# EAGLE design conector_santec (EAGLE 7.5.0)
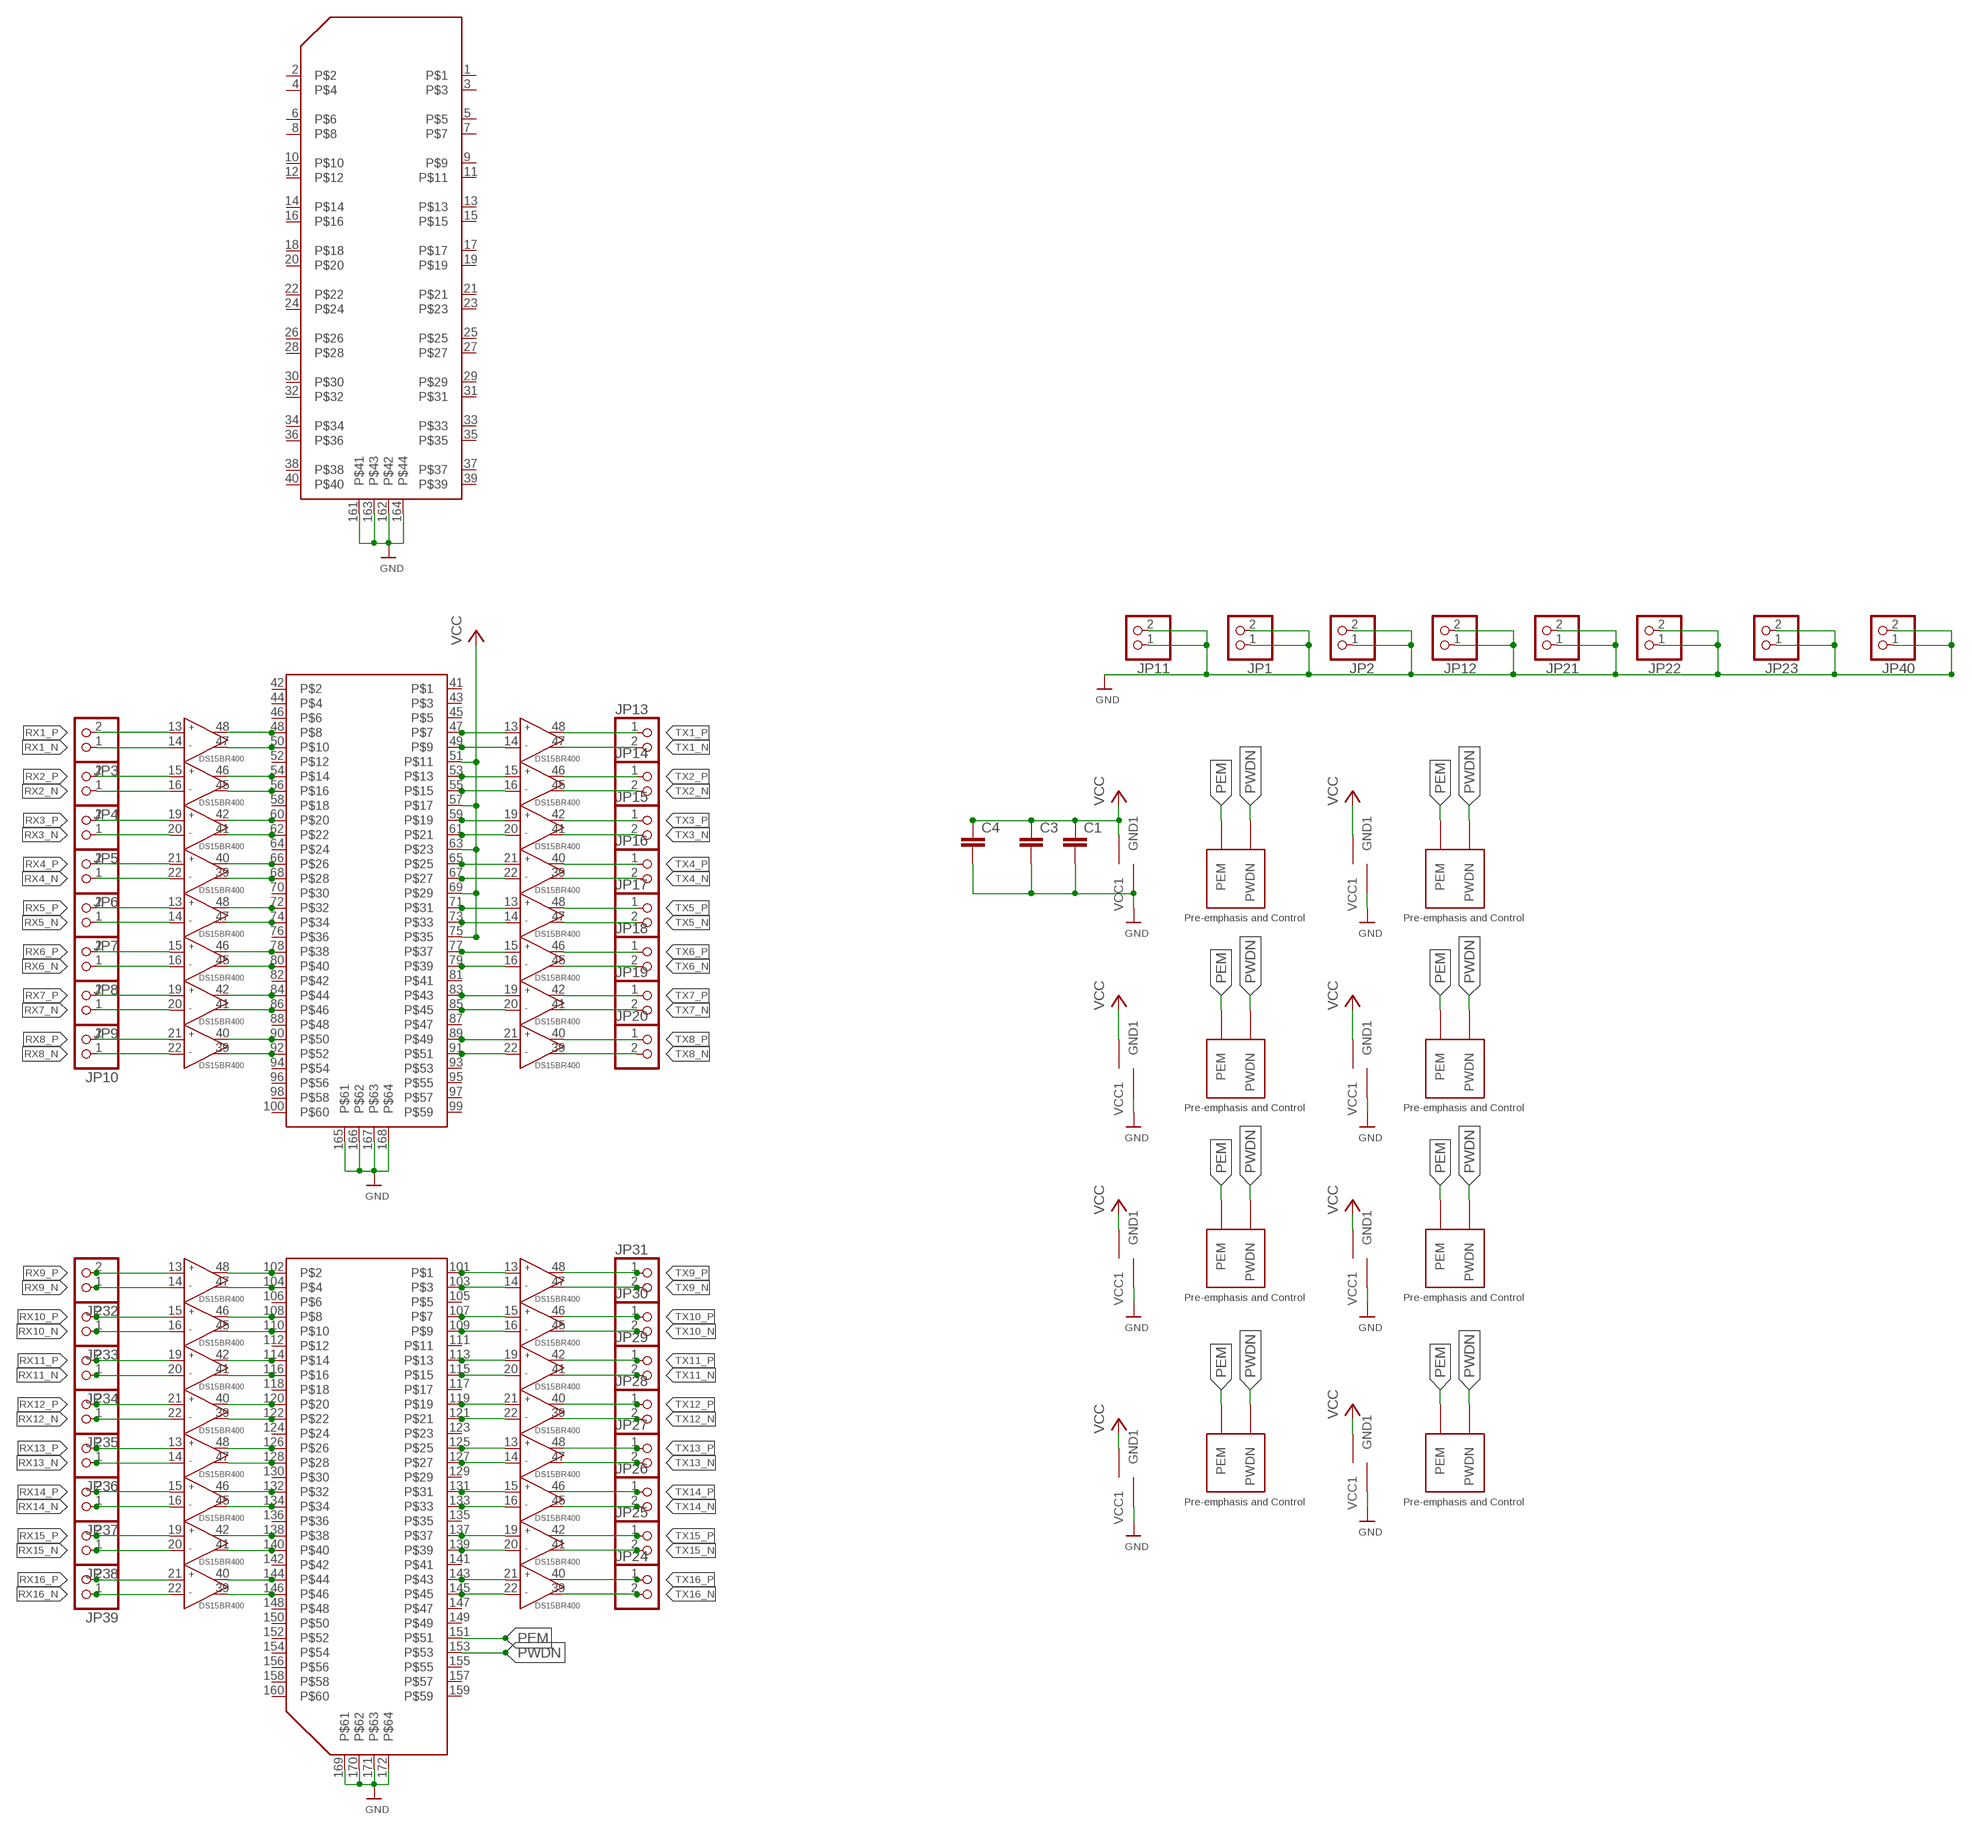
[diagram p0: schematic, sheet 1]

## Parts
C1  C-EUC0603  [C0603]
C3  C-EUC0603  [C0603]
C4  C-EUC0603  [C0603]
JP1  HEADER-1X2ROUND  [1X02_ROUND]
JP2  HEADER-1X2ROUND  [1X02_ROUND]
JP3  HEADER-1X2ROUND  [1X02_ROUND]
JP4  HEADER-1X2ROUND  [1X02_ROUND]
JP5  HEADER-1X2ROUND  [1X02_ROUND]
JP6  HEADER-1X2ROUND  [1X02_ROUND]
JP7  HEADER-1X2ROUND  [1X02_ROUND]
JP8  HEADER-1X2ROUND  [1X02_ROUND]
JP9  HEADER-1X2ROUND  [1X02_ROUND]
JP10  HEADER-1X2ROUND  [1X02_ROUND]
JP11  HEADER-1X2ROUND  [1X02_ROUND]
JP12  HEADER-1X2ROUND  [1X02_ROUND]
JP13  HEADER-1X2ROUND  [1X02_ROUND]
JP14  HEADER-1X2ROUND  [1X02_ROUND]
JP15  HEADER-1X2ROUND  [1X02_ROUND]
JP16  HEADER-1X2ROUND  [1X02_ROUND]
JP17  HEADER-1X2ROUND  [1X02_ROUND]
JP18  HEADER-1X2ROUND  [1X02_ROUND]
JP19  HEADER-1X2ROUND  [1X02_ROUND]
JP20  HEADER-1X2ROUND  [1X02_ROUND]
JP21  HEADER-1X2ROUND  [1X02_ROUND]
JP22  HEADER-1X2ROUND  [1X02_ROUND]
JP23  HEADER-1X2ROUND  [1X02_ROUND]
JP24  HEADER-1X2ROUND  [1X02_ROUND]
JP25  HEADER-1X2ROUND  [1X02_ROUND]
JP26  HEADER-1X2ROUND  [1X02_ROUND]
JP27  HEADER-1X2ROUND  [1X02_ROUND]
JP28  HEADER-1X2ROUND  [1X02_ROUND]
JP29  HEADER-1X2ROUND  [1X02_ROUND]
JP30  HEADER-1X2ROUND  [1X02_ROUND]
JP31  HEADER-1X2ROUND  [1X02_ROUND]
JP32  HEADER-1X2ROUND  [1X02_ROUND]
JP33  HEADER-1X2ROUND  [1X02_ROUND]
JP34  HEADER-1X2ROUND  [1X02_ROUND]
JP35  HEADER-1X2ROUND  [1X02_ROUND]
JP36  HEADER-1X2ROUND  [1X02_ROUND]
JP37  HEADER-1X2ROUND  [1X02_ROUND]
JP38  HEADER-1X2ROUND  [1X02_ROUND]
JP39  HEADER-1X2ROUND  [1X02_ROUND]
JP40  HEADER-1X2ROUND  [1X02_ROUND]
U$1  SAMTEC_ASP-122952-01  [ASP-122952-01]
U$4  DS15BR400  [TQFP48]
U$6  DS15BR400  [TQFP48]
U$7  DS15BR400  [TQFP48]
U$8  DS15BR400  [TQFP48]
U$15  DS15BR400  [TQFP48]
U$16  DS15BR400  [TQFP48]
U$17  DS15BR400  [TQFP48]
U$18  DS15BR400  [TQFP48]

## Nets
GND [lvds]: C1.2 C3.2 C4.2 JP1.1 JP1.2 JP2.1 JP2.2 JP11.1 JP11.2 JP12.1 JP12.2 JP21.1 JP21.2 JP22.1 JP22.2 JP23.1 JP23.2 JP40.1 JP40.2 U$1.161 U$1.162 U$1.163 U$1.164 U$1.165 U$1.166 U$1.167 U$1.168 U$1.169 U$1.170 U$1.171 U$1.172 U$4.8(GND1) U$4.9(GND1) U$4.17(GND1) U$4.18(GND1) U$4.23(GND1) U$4.24(GND1) U$4.37(GND1) U$4.38(GND1) U$4.43(GND1) U$4.44(GND1) U$6.8(GND1) U$6.9(GND1) U$6.17(GND1) U$6.18(GND1) U$6.23(GND1) U$6.24(GND1) U$6.37(GND1) U$6.38(GND1) U$6.43(GND1) U$6.44(GND1) U$7.8(GND1) U$7.9(GND1) U$7.17(GND1) U$7.18(GND1) U$7.23(GND1) U$7.24(GND1) U$7.37(GND1) U$7.38(GND1) U$7.43(GND1) U$7.44(GND1) U$8.8(GND1) U$8.9(GND1) U$8.17(GND1) U$8.18(GND1) U$8.23(GND1) U$8.24(GND1) U$8.37(GND1) U$8.38(GND1) U$8.43(GND1) U$8.44(GND1) U$15.8(GND1) U$15.9(GND1) U$15.17(GND1) U$15.18(GND1) U$15.23(GND1) U$15.24(GND1) U$15.37(GND1) U$15.38(GND1) U$15.43(GND1) U$15.44(GND1) U$16.8(GND1) U$16.9(GND1) U$16.17(GND1) U$16.18(GND1) U$16.23(GND1) U$16.24(GND1) U$16.37(GND1) U$16.38(GND1) U$16.43(GND1) U$16.44(GND1) U$17.8(GND1) U$17.9(GND1) U$17.17(GND1) U$17.18(GND1) U$17.23(GND1) U$17.24(GND1) U$17.37(GND1) U$17.38(GND1) U$17.43(GND1) U$17.44(GND1) U$18.8(GND1) U$18.9(GND1) U$18.17(GND1) U$18.18(GND1) U$18.23(GND1) U$18.24(GND1) U$18.37(GND1) U$18.38(GND1) U$18.43(GND1) U$18.44(GND1)
PEM: U$1.151 U$4.2(PEM) U$6.2(PEM) U$7.2(PEM) U$8.2(PEM) U$15.2(PEM) U$16.2(PEM) U$17.2(PEM) U$18.2(PEM)
PWDN: U$1.153 U$4.12(PWDN) U$6.12(PWDN) U$7.12(PWDN) U$8.12(PWDN) U$15.12(PWDN) U$16.12(PWDN) U$17.12(PWDN) U$18.12(PWDN)
RX1_N [lvds]: JP3.1 U$7.14(IN-)
RX1_P [lvds]: JP3.2 U$7.13(IN+)
RX1IN_N [lvds]: U$1.50 U$7.47(OUT-)
RX1IN_P [lvds]: U$1.48 U$7.48(OUT+)
RX2_N [lvds]: JP4.1 U$7.16(IN-)
RX2_P [lvds]: JP4.2 U$7.15(IN+)
RX2IN_N [lvds]: U$1.56 U$7.45(OUT-)
RX2IN_P [lvds]: U$1.54 U$7.46(OUT+)
RX3_N [lvds]: JP5.1 U$7.20(IN-)
RX3_P [lvds]: JP5.2 U$7.19(IN+)
RX3IN_N [lvds]: U$1.62 U$7.41(OUT-)
RX3IN_P [lvds]: U$1.60 U$7.42(OUT+)
RX4_N [lvds]: JP6.1 U$7.22(IN-)
RX4_P [lvds]: JP6.2 U$7.21(IN+)
RX4IN_N [lvds]: U$1.68 U$7.39(OUT-)
RX4IN_P [lvds]: U$1.66 U$7.40(OUT+)
RX5_N [lvds]: JP7.1 U$8.14(IN-)
RX5_P [lvds]: JP7.2 U$8.13(IN+)
RX5IN_N [lvds]: U$1.74 U$8.47(OUT-)
RX5IN_P [lvds]: U$1.72 U$8.48(OUT+)
RX6_N [lvds]: JP8.1 U$8.16(IN-)
RX6_P [lvds]: JP8.2 U$8.15(IN+)
RX6IN_N [lvds]: U$1.80 U$8.45(OUT-)
RX6IN_P [lvds]: U$1.78 U$8.46(OUT+)
RX7_N [lvds]: JP9.1 U$8.20(IN-)
RX7_P [lvds]: JP9.2 U$8.19(IN+)
RX7IN_N [lvds]: U$1.86 U$8.41(OUT-)
RX7IN_P [lvds]: U$1.84 U$8.42(OUT+)
RX8_N [lvds]: JP10.1 U$8.22(IN-)
RX8_P [lvds]: JP10.2 U$8.21(IN+)
RX8IN_N [lvds]: U$1.92 U$8.39(OUT-)
RX8IN_P [lvds]: U$1.90 U$8.40(OUT+)
RX9_N [lvds]: JP32.1 U$17.14(IN-)
RX9_P [lvds]: JP32.2 U$17.13(IN+)
RX9IN_N [lvds]: U$1.104 U$17.47(OUT-)
RX9IN_P [lvds]: U$1.102 U$17.48(OUT+)
RX10_N [lvds]: JP33.1 U$17.16(IN-)
RX10_P [lvds]: JP33.2 U$17.15(IN+)
RX10IN_N [lvds]: U$1.110 U$17.45(OUT-)
RX10IN_P [lvds]: U$1.108 U$17.46(OUT+)
RX11_N [lvds]: JP34.1 U$17.20(IN-)
RX11_P [lvds]: JP34.2 U$17.19(IN+)
RX11IN_N [lvds]: U$1.116 U$17.41(OUT-)
RX11IN_P [lvds]: U$1.114 U$17.42(OUT+)
RX12_N [lvds]: JP35.1 U$17.22(IN-)
RX12_P [lvds]: JP35.2 U$17.21(IN+)
RX12IN_N [lvds]: U$1.122 U$17.39(OUT-)
RX12IN_P [lvds]: U$1.120 U$17.40(OUT+)
RX13_N [lvds]: JP36.1 U$18.14(IN-)
RX13_P [lvds]: JP36.2 U$18.13(IN+)
RX13IN_N [lvds]: U$1.128 U$18.47(OUT-)
RX13IN_P [lvds]: U$1.126 U$18.48(OUT+)
RX14_N [lvds]: JP37.1 U$18.16(IN-)
RX14_P [lvds]: JP37.2 U$18.15(IN+)
RX14IN_N [lvds]: U$1.134 U$18.45(OUT-)
RX14IN_P [lvds]: U$1.132 U$18.46(OUT+)
RX15_N [lvds]: JP38.1 U$18.20(IN-)
RX15_P [lvds]: JP38.2 U$18.19(IN+)
RX15IN_N [lvds]: U$1.140 U$18.41(OUT-)
RX15IN_P [lvds]: U$1.138 U$18.42(OUT+)
RX16_N [lvds]: JP39.1 U$18.22(IN-)
RX16_P [lvds]: JP39.2 U$18.21(IN+)
RX16IN_N [lvds]: U$1.146 U$18.39(OUT-)
RX16IN_P [lvds]: U$1.144 U$18.40(OUT+)
TX1_N [lvds]: JP13.2 U$4.47(OUT-)
TX1_P [lvds]: JP13.1 U$4.48(OUT+)
TX1IN_N [lvds]: U$1.49 U$4.14(IN-)
TX1IN_P [lvds]: U$1.47 U$4.13(IN+)
TX2_N [lvds]: JP14.2 U$4.45(OUT-)
TX2_P [lvds]: JP14.1 U$4.46(OUT+)
TX2IN_N [lvds]: U$1.55 U$4.16(IN-)
TX2IN_P [lvds]: U$1.53 U$4.15(IN+)
TX3_N [lvds]: JP15.2 U$4.41(OUT-)
TX3_P [lvds]: JP15.1 U$4.42(OUT+)
TX3IN_N [lvds]: U$1.61 U$4.20(IN-)
TX3IN_P [lvds]: U$1.59 U$4.19(IN+)
TX4_N [lvds]: JP16.2 U$4.39(OUT-)
TX4_P [lvds]: JP16.1 U$4.40(OUT+)
TX4IN_N [lvds]: U$1.67 U$4.22(IN-)
TX4IN_P [lvds]: U$1.65 U$4.21(IN+)
TX5_N [lvds]: JP17.2 U$6.47(OUT-)
TX5_P [lvds]: JP17.1 U$6.48(OUT+)
TX5IN_N [lvds]: U$1.73 U$6.14(IN-)
TX5IN_P [lvds]: U$1.71 U$6.13(IN+)
TX6_N [lvds]: JP18.2 U$6.45(OUT-)
TX6_P [lvds]: JP18.1 U$6.46(OUT+)
TX6IN_N [lvds]: U$1.79 U$6.16(IN-)
TX6IN_P [lvds]: U$1.77 U$6.15(IN+)
TX7_N [lvds]: JP19.2 U$6.41(OUT-)
TX7_P [lvds]: JP19.1 U$6.42(OUT+)
TX7IN_N [lvds]: U$1.85 U$6.20(IN-)
TX7IN_P [lvds]: U$1.83 U$6.19(IN+)
TX8_N [lvds]: JP20.2 U$6.39(OUT-)
TX8_P [lvds]: JP20.1 U$6.40(OUT+)
TX8IN_N [lvds]: U$1.91 U$6.22(IN-)
TX8IN_P [lvds]: U$1.89 U$6.21(IN+)
TX9_N [lvds]: JP31.2 U$15.47(OUT-)
TX9_P [lvds]: JP31.1 U$15.48(OUT+)
TX9IN_N [lvds]: U$1.103 U$15.14(IN-)
TX9IN_P [lvds]: U$1.101 U$15.13(IN+)
TX10_N [lvds]: JP30.2 U$15.45(OUT-)
TX10_P [lvds]: JP30.1 U$15.46(OUT+)
TX10IN_N [lvds]: U$1.109 U$15.16(IN-)
TX10IN_P [lvds]: U$1.107 U$15.15(IN+)
TX11_N [lvds]: JP29.2 U$15.41(OUT-)
TX11_P [lvds]: JP29.1 U$15.42(OUT+)
TX11IN_N [lvds]: U$1.115 U$15.20(IN-)
TX11IN_P [lvds]: U$1.113 U$15.19(IN+)
TX12_N [lvds]: JP28.2 U$15.39(OUT-)
TX12_P [lvds]: JP28.1 U$15.40(OUT+)
TX12IN_N [lvds]: U$1.121 U$15.22(IN-)
TX12IN_P [lvds]: U$1.119 U$15.21(IN+)
TX13_N [lvds]: JP27.2 U$16.47(OUT-)
TX13_P [lvds]: JP27.1 U$16.48(OUT+)
TX13IN_N [lvds]: U$1.127 U$16.14(IN-)
TX13IN_P [lvds]: U$1.125 U$16.13(IN+)
TX14_N [lvds]: JP26.2 U$16.45(OUT-)
TX14_P [lvds]: JP26.1 U$16.46(OUT+)
TX14IN_N [lvds]: U$1.133 U$16.16(IN-)
TX14IN_P [lvds]: U$1.131 U$16.15(IN+)
TX15_N [lvds]: JP25.2 U$16.41(OUT-)
TX15_P [lvds]: JP25.1 U$16.42(OUT+)
TX15IN_N [lvds]: U$1.139 U$16.20(IN-)
TX15IN_P [lvds]: U$1.137 U$16.19(IN+)
TX16_N [lvds]: JP24.2 U$16.39(OUT-)
TX16_P [lvds]: JP24.1 U$16.40(OUT+)
TX16IN_N [lvds]: U$1.145 U$16.22(IN-)
TX16IN_P [lvds]: U$1.143 U$16.21(IN+)
VCC: C1.1 C3.1 C4.1 U$1.51 U$1.57 U$1.63 U$1.69 U$1.75 U$4.3(VCC1) U$4.4(VCC1) U$4.5(VCC1) U$4.7(VCC1) U$4.10(VCC1) U$4.11(VCC1) U$4.28(VCC1) U$4.29(VCC1) U$4.30(VCC1) U$4.32(VCC1) U$4.33(VCC1) U$6.3(VCC1) U$6.4(VCC1) U$6.5(VCC1) U$6.7(VCC1) U$6.10(VCC1) U$6.11(VCC1) U$6.28(VCC1) U$6.29(VCC1) U$6.30(VCC1) U$6.32(VCC1) U$6.33(VCC1) U$7.3(VCC1) U$7.4(VCC1) U$7.5(VCC1) U$7.7(VCC1) U$7.10(VCC1) U$7.11(VCC1) U$7.28(VCC1) U$7.29(VCC1) U$7.30(VCC1) U$7.32(VCC1) U$7.33(VCC1) U$8.3(VCC1) U$8.4(VCC1) U$8.5(VCC1) U$8.7(VCC1) U$8.10(VCC1) U$8.11(VCC1) U$8.28(VCC1) U$8.29(VCC1) U$8.30(VCC1) U$8.32(VCC1) U$8.33(VCC1) U$15.3(VCC1) U$15.4(VCC1) U$15.5(VCC1) U$15.7(VCC1) U$15.10(VCC1) U$15.11(VCC1) U$15.28(VCC1) U$15.29(VCC1) U$15.30(VCC1) U$15.32(VCC1) U$15.33(VCC1) U$16.3(VCC1) U$16.4(VCC1) U$16.5(VCC1) U$16.7(VCC1) U$16.10(VCC1) U$16.11(VCC1) U$16.28(VCC1) U$16.29(VCC1) U$16.30(VCC1) U$16.32(VCC1) U$16.33(VCC1) U$17.3(VCC1) U$17.4(VCC1) U$17.5(VCC1) U$17.7(VCC1) U$17.10(VCC1) U$17.11(VCC1) U$17.28(VCC1) U$17.29(VCC1) U$17.30(VCC1) U$17.32(VCC1) U$17.33(VCC1) U$18.3(VCC1) U$18.4(VCC1) U$18.5(VCC1) U$18.7(VCC1) U$18.10(VCC1) U$18.11(VCC1) U$18.28(VCC1) U$18.29(VCC1) U$18.30(VCC1) U$18.32(VCC1) U$18.33(VCC1)
Unconnected: U$1.1 U$1.2 U$1.3 U$1.4 U$1.5 U$1.6 U$1.7 U$1.8 U$1.9 U$1.10 U$1.11 U$1.12 U$1.13 U$1.14 U$1.15 U$1.16 U$1.17 U$1.18 U$1.19 U$1.20 U$1.21 U$1.22 U$1.23 U$1.24 U$1.25 U$1.26 U$1.27 U$1.28 U$1.29 U$1.30 U$1.31 U$1.32 U$1.33 U$1.34 U$1.35 U$1.36 U$1.37 U$1.38 U$1.39 U$1.40 U$1.41 U$1.42 U$1.43 U$1.44 U$1.45 U$1.46 U$1.52 U$1.58 U$1.64 U$1.70 U$1.76 U$1.81 U$1.82 U$1.87 U$1.88 U$1.93 U$1.94 U$1.95 U$1.96 U$1.97 U$1.98 U$1.99 U$1.100 U$1.105 U$1.106 U$1.111 U$1.112 U$1.117 U$1.118 U$1.123 U$1.124 U$1.129 U$1.130 U$1.135 U$1.136 U$1.141 U$1.142 U$1.147 U$1.148 U$1.149 U$1.150 U$1.152 U$1.154 U$1.155 U$1.156 U$1.157 U$1.158 U$1.159 U$1.160

## Library data of the parts
C1 C3 C4 = rcl:C-EU: CAPACITOR, European symbol
JP1-JP40 = junior:HEADER-1X2: PIN HEADER
U$1 = junior:SAMTEC_ASP-122952-01
U$4 U$6-U$8 U$15-U$18 = National:DS15BR400

## Net classes
0 default: width 0.305 mm
1 lvds: width 0.305 mm

## Board
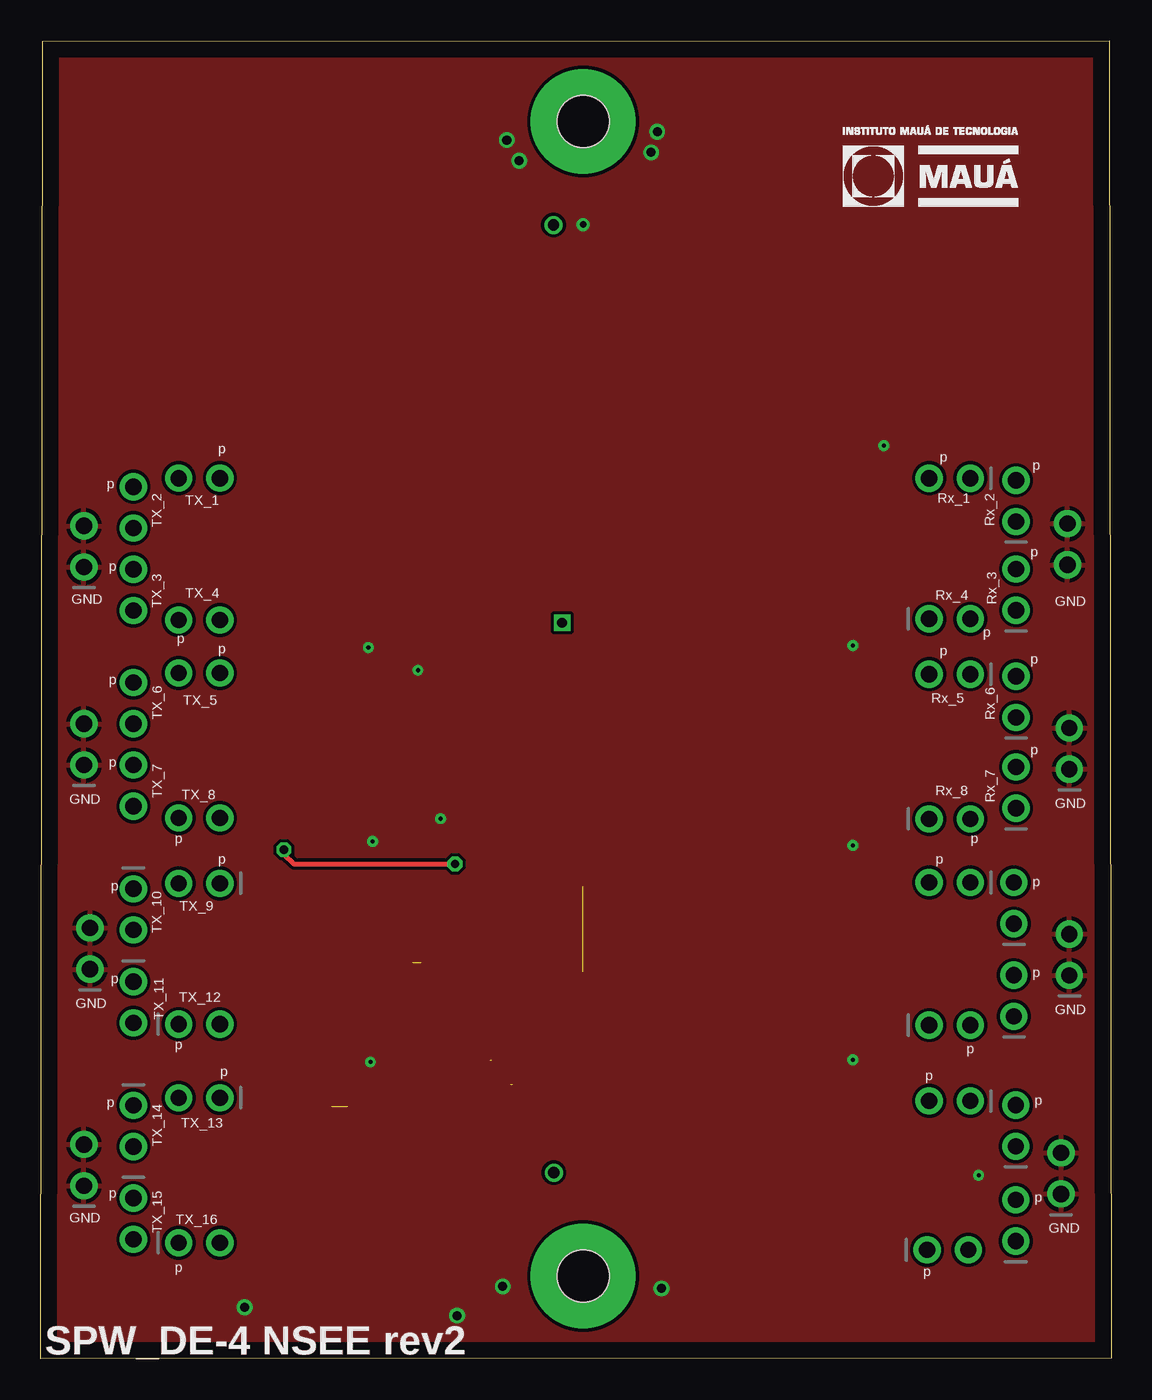
[diagram p1: board, top side]
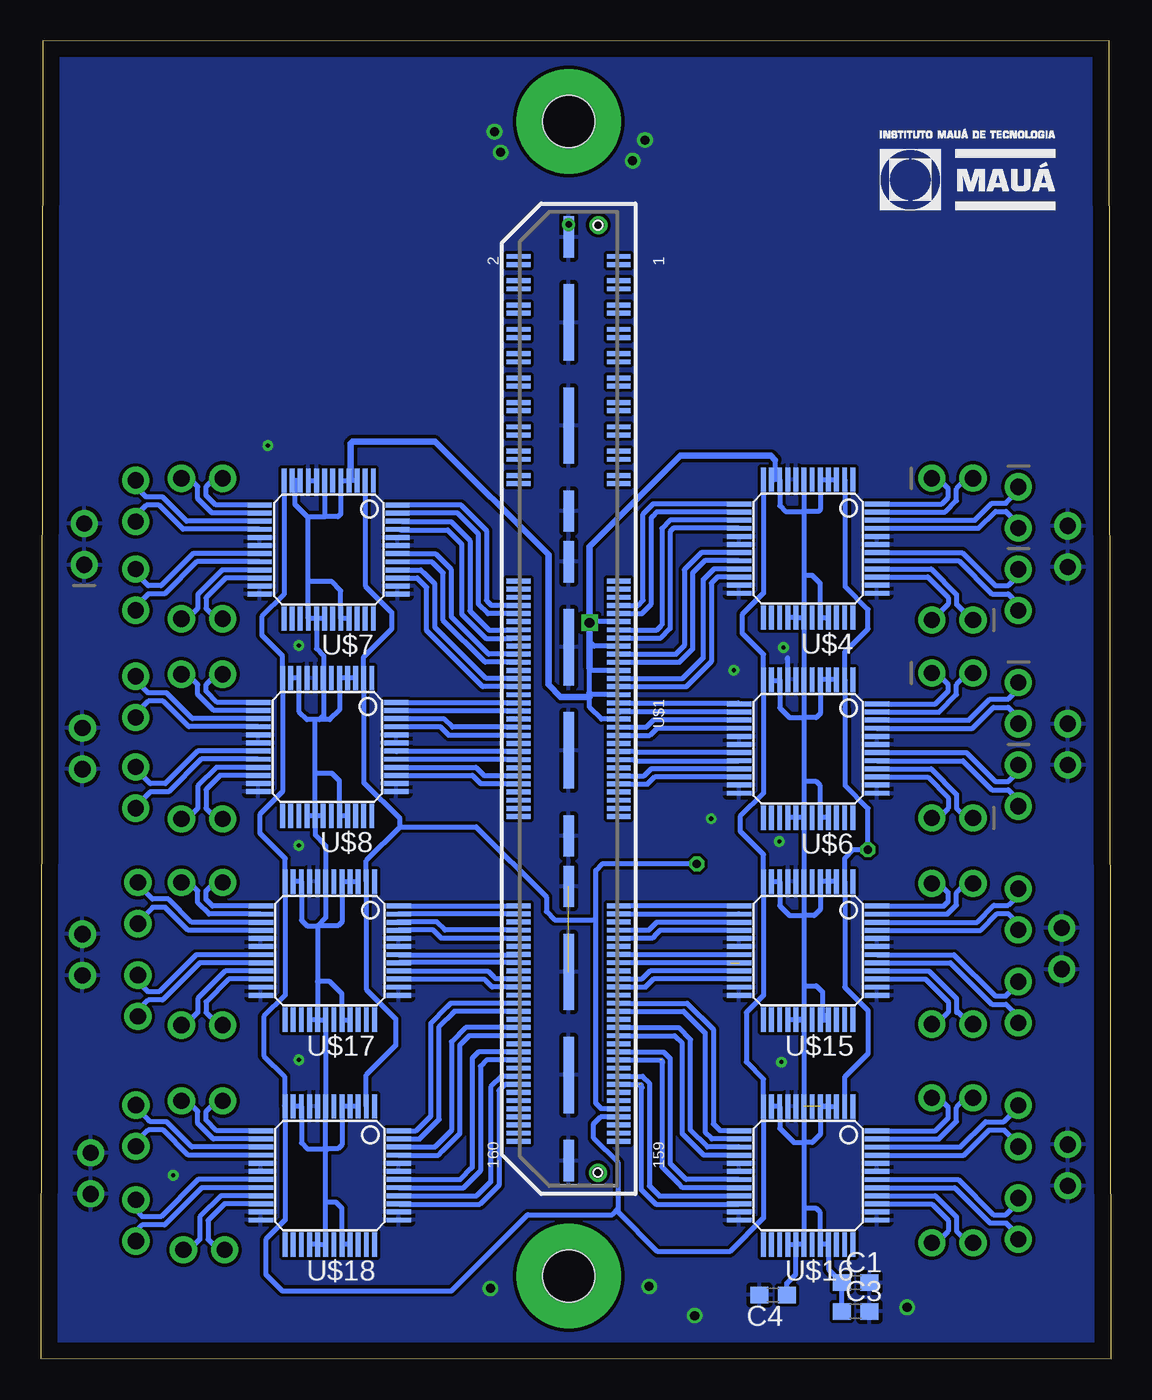
[diagram p2: board, bottom side, seen from below]

Size 65.95 x 81.2 mm. Coordinates in mm from the lower left corner, seen from the top.
Outline: 65.95,0.05 0,0 0.13,81.15 65.82,81.2 65.95,0.05
Copper layers (1*16): Top 0.035mm / dielectric 1.5mm / Bottom 0.035mm
Design rules "default *": minimum track width 10mil, minimum drill 24mil, track to track 8mil, track to pad 8mil, pad to pad 8mil, via to via 8mil, smd to smd 8mil, copper to edge 40mil, drill to drill 8mil, minimum pad ring 10mil, minimum via ring 8mil, stop-mask expansion 4mil, vias tented up to drill 0mil, thermal gap 10mil
Holes 3.2 mm at 33.42,76.22 33.42,5.1

### Footprints (pad centres in the part's own frame; a part is rotated, then mirrored left to right if it is on the bottom)
C0603 = smd 1.1 x 1: 1 -0.85,0; 2 0.85,0
1X02_ROUND = drill 1 pad 1.676: 1 -1.27,0; 2 1.27,0
ASP-122952-01 = smd 0.3 x 1.45: 1 -27.25,3.09; 2 -27.25,-3.09; 3 -26.75,3.09; 4 -26.75,-3.09; 5 -25.75,3.09; 6 -25.75,-3.09; 7 -25.25,3.09; 8 -25.25,-3.09; 9 -24.25,3.09; 10 -24.25,-3.09; 11 -23.75,3.09; 12 -23.75,-3.09; 13 -22.75,3.09; 14 -22.75,-3.09; 15 -22.25,3.09; 16 -22.25,-3.09; 17 -21.25,3.09; 18 -21.25,-3.09; 19 -20.75,3.09; 20 -20.75,-3.09; 21 -19.75,3.09; 22 -19.75,-3.09; 23 -19.25,3.09; 24 -19.25,-3.09; 25 -18.25,3.09; 26 -18.25,-3.09; 27 -17.75,3.09; 28 -17.75,-3.09; 29 -16.75,3.09; 30 -16.75,-3.09; 31 -16.25,3.09; 32 -16.25,-3.09; 33 -15.25,3.09; 34 -15.25,-3.09; 35 -14.75,3.09; 36 -14.75,-3.09; 37 -13.75,3.09; 38 -13.75,-3.09; 39 -13.25,3.09; 40 -13.25,-3.09; 41 -7.25,3.09; 42 -7.25,-3.09; 43 -6.75,3.09; 44 -6.75,-3.09; 45 -6.25,3.09; 46 -6.25,-3.09; 47 -5.75,3.09; 48 -5.75,-3.09; 49 -5.25,3.09; 50 -5.25,-3.09; 51 -4.75,3.09; 52 -4.75,-3.09; 53 -4.25,3.09; 54 -4.25,-3.09; 55 -3.75,3.09; 56 -3.75,-3.09; 57 -3.25,3.09; 58 -3.25,-3.09; 59 -2.75,3.09; 60 -2.75,-3.09; 61 -2.25,3.09; 62 -2.25,-3.09; 63 -1.75,3.09; 64 -1.75,-3.09; 65 -1.25,3.09; 66 -1.25,-3.09; 67 -0.75,3.09; 68 -0.75,-3.09; 69 -0.25,3.09; 70 -0.25,-3.09; 71 0.25,3.09; 72 0.25,-3.09; 73 0.75,3.09; 74 0.75,-3.09; 75 1.25,3.09; 76 1.25,-3.09; 77 1.75,3.09; 78 1.75,-3.09; 79 2.25,3.09; 80 2.25,-3.09; 81 2.75,3.09; 82 2.75,-3.09; 83 3.25,3.09; 84 3.25,-3.09; 85 3.75,3.09; 86 3.75,-3.09; 87 4.25,3.09; 88 4.25,-3.09; 89 4.75,3.09; 90 4.75,-3.09; 91 5.25,3.09; 92 5.25,-3.09; 93 5.75,3.09; 94 5.75,-3.09; 95 6.25,3.09; 96 6.25,-3.09; 97 6.75,3.09; 98 6.75,-3.09; 99 7.25,3.09; 100 7.25,-3.09; 101 12.75,3.09; 102 12.75,-3.09; 103 13.25,3.09; 104 13.25,-3.09; 105 13.75,3.09; 106 13.75,-3.09; 107 14.25,3.09; 108 14.25,-3.09; 109 14.75,3.09; 110 14.75,-3.09; 111 15.25,3.09; 112 15.25,-3.09; 113 15.75,3.09; 114 15.75,-3.09; 115 16.25,3.09; 116 16.25,-3.09; 117 16.75,3.09; 118 16.75,-3.09; 119 17.25,3.09; 120 17.25,-3.09; 121 17.75,3.09; 122 17.75,-3.09; 123 18.25,3.09; 124 18.25,-3.09; 125 18.75,3.09; 126 18.75,-3.09; 127 19.25,3.09; 128 19.25,-3.09; 129 19.75,3.09; 130 19.75,-3.09; 131 20.25,3.09; 132 20.25,-3.09; 133 20.75,3.09; 134 20.75,-3.09; 135 21.25,3.09; 136 21.25,-3.09; 137 21.75,3.09; 138 21.75,-3.09; 139 22.25,3.09; 140 22.25,-3.09; 141 22.75,3.09; 142 22.75,-3.09; 143 23.25,3.09; 144 23.25,-3.09; 145 23.75,3.09; 146 23.75,-3.09; 147 24.25,3.09; 148 24.25,-3.09; 149 24.75,3.09; 150 24.75,-3.09; 151 25.25,3.09; 152 25.25,-3.09; 153 25.75,3.09; 154 25.75,-3.09; 155 26.25,3.09; 156 26.25,-3.09; 157 26.75,3.09; 158 26.75,-3.09; 159 27.25,3.09; 160 27.25,-3.09 | smd 2.54 x 0.64: 161 -28.445,0; 164 -11.555,0; 165 -8.445,0; 168 8.445,0; 169 11.555,0; 172 28.445,0 | smd 4.7 x 0.64: 162 -23.175,0; 163 -16.825,0; 166 -3.175,0; 167 3.175,0; 170 16.825,0; 171 23.175,0
TQFP48 = smd 0.3 x 1.5: 1 -2.75,-4.25; 2 -2.25,-4.25; 3 -1.75,-4.25; 4 -1.25,-4.25; 5 -0.75,-4.25; 6 -0.25,-4.25; 7 0.25,-4.25; 8 0.75,-4.25; 9 1.25,-4.25; 10 1.75,-4.25; 11 2.25,-4.25; 12 2.75,-4.25; 25 2.75,4.25; 26 2.25,4.25; 27 1.75,4.25; 28 1.25,4.25; 29 0.75,4.25; 30 0.25,4.25; 31 -0.25,4.25; 32 -0.75,4.25; 33 -1.25,4.25; 34 -1.75,4.25; 35 -2.25,4.25; 36 -2.75,4.25 | smd 1.5 x 0.3: 13 4.25,-2.75; 14 4.25,-2.25; 15 4.25,-1.75; 16 4.25,-1.25; 17 4.25,-0.75; 18 4.25,-0.25; 19 4.25,0.25; 20 4.25,0.75; 21 4.25,1.25; 22 4.25,1.75; 23 4.25,2.25; 24 4.25,2.75; 37 -4.25,2.75; 38 -4.25,2.25; 39 -4.25,1.75; 40 -4.25,1.25; 41 -4.25,0.75; 42 -4.25,0.25; 43 -4.25,-0.25; 44 -4.25,-0.75; 45 -4.25,-1.25; 46 -4.25,-1.75; 47 -4.25,-2.25; 48 -4.25,-2.75

### Placement (x,y rotation side)
C1  15.75,4.7 0 bottom
C3  15.75,2.92 0 bottom
C4  20.83,3.94 180 bottom
JP1  63.37,37.59 90 top
JP2  63.37,24.89 90 top
JP3  56.01,54.24 180 top
JP4  60.08,52.85 90 top
JP5  60.08,47.39 90 top
JP6  56.01,45.58 0 top
JP7  56.01,42.18 180 top
JP8  60.08,40.78 90 top
JP9  60.08,35.19 90 top
JP10  56.01,33.26 0 top
JP11  63.26,50.18 90 bottom
JP12  62.86,11.43 90 top
JP13  9.78,54.25 0 bottom
JP14  5.71,52.45 270 bottom
JP15  5.71,47.37 270 bottom
JP16  9.78,45.51 180 bottom
JP17  9.78,42.25 0 bottom
JP18  5.71,40.39 270 bottom
JP19  5.71,35.31 270 bottom
JP20  9.78,33.32 180 bottom
JP21  2.67,50.04 90 top
JP22  2.67,37.85 90 top
JP23  3.05,25.27 90 top
JP24  9.78,7.16 0 top
JP25  5.71,8.64 270 top
JP26  5.71,14.35 270 top
JP27  9.78,16.09 180 top
JP28  9.78,20.62 0 top
JP29  5.71,21.97 270 top
JP30  5.71,27.69 270 top
JP31  9.78,29.29 180 top
JP32  56.01,29.35 180 top
JP33  59.96,28.08 90 top
JP34  59.96,22.37 90 top
JP35  56.01,20.56 0 top
JP36  56.01,15.89 180 top
JP37  60.07,14.37 90 top
JP38  60.07,8.52 90 top
JP39  55.88,6.72 0 top
JP40  2.67,11.94 90 top
U$1  33.42,40.66 270 bottom
U$2  [LOGO_MAUA]  49.42,70.98 0 top
U$3  [LOGO_MAUA]  14.24,70.76 0 bottom
U$4  18.67,49.91 180 bottom
U$6  18.67,37.59 180 bottom
U$7  48.2,49.85 180 bottom
U$8  48.29,37.69 180 bottom
U$15  18.67,25.15 180 bottom
U$16  18.67,11.3 180 bottom
U$17  48.13,25.15 180 bottom
U$18  48.13,11.3 180 bottom

### Tracks (layer width: path | path; a pad name or v marks a point on that pad's centre or on a via)
GND  (via drill 0.25, 0.4, 0.56)  (1 unrouted)
  Bottom 0.305: U$7.9 U$7.8 | U$6.9 19.92,43.03 19.94,43.05 19.94,43.18
  other vias: 33.42,69.87 25.65,2.67 38.24,4.34 28.46,4.46 12.57,3.18 37.99,75.58 37.61,74.31 28.72,75.08 29.48,73.81 20.45,31.88 24.64,33.27 20.19,43.81 23.24,42.42 20.32,18.29 50.04,18.41 57.79,11.3 50.04,31.62 50.04,43.94 51.94,56.26
  pour Bottom: 0.38,81.91 91.95,80.9 91.95,-0.63 0.38,0.38
  pour Top: -0.63,81.66 71.63,81.66 71.63,-5.71 -0.63,-5.71
N$1  (via drill 0.7)
  other vias: 31.59,69.84
N$2  (via drill 0.7)
  other vias: 31.62,11.47
N$3  (via drill 3.2 pad 6.45)
  other vias: 33.42,76.22
N$4  (via drill 3.2 pad 6.45)
  other vias: 33.42,5.1
PEM  (via drill 0.51)
  Top 0.305: v14.99,31.37 14.99,31.12 15.62,30.48 v25.53,30.48
  Bottom 0.305: U$16.2 16.42,17.36 14.99,18.8 14.99,21.46 16.42,22.9 U$15.2 16.42,30.82 15.87,31.37 v14.99,31.37 14.99,33.91 16.38,35.31 16.38,40 16.42,40.04 U$6.2 16.42,43.52 14.99,44.96 14.99,46.16 16.38,47.56 16.38,52.83 16.42,52.87 U$4.2 | U$1.151 31.45,15.41 31.45,15.45 31.75,15.75 31.75,26.92 | 31.75,26.92 31.75,30.1 31.37,30.48 v25.53,30.48 | U$7.2 45.95,47.6 44.32,45.97 44.32,44.96 46.04,43.24 U$8.2 46.04,35.5 43.82,33.27 43.82,32.77 | 43.82,32.77 45.88,30.7 U$17.2 45.88,22.77 44.07,20.95 44.07,19.3 45.88,17.49 U$18.2 | 43.82,32.77 39.12,32.77 34.8,28.45 34.8,27.56 34.29,27.05 31.88,27.05 31.75,26.92
PWDN
  Bottom 0.305: U$7.12 50.95,47.09 52.32,45.72 52.32,44.58 51.04,43.29 U$8.12 51.04,34.94 52.45,33.53 52.45,32.38 50.88,30.82 U$17.12 50.88,22.4 52.2,21.08 52.2,18.67 50.93,17.4 50.93,15.6 U$18.12 50.88,8.55 52.07,7.37 52.07,5.21 51.05,4.19 40.64,4.19 35.94,8.89 30.73,8.89 30.35,9.27 | U$4.12 21.42,47.16 22.73,45.85 22.73,44.7 21.42,43.39 U$6.12 21.42,34.84 22.86,33.4 22.86,32.51 21.42,31.07 U$15.12 21.42,22.4 22.48,21.34 22.48,18.29 21.42,17.23 U$16.12 21.42,8.68 23.49,6.6 27.94,6.6 30.35,9.02 30.35,9.27 | 30.35,9.27 30.35,12.06 31.88,13.59 31.88,14.48 31.45,14.91 U$1.153
RX1_N
  Bottom 0.305: U$7.14 55.38,52.1 56.26,52.98 56.26,53.72 56.78,54.24 JP3.1
RX1_P
  Bottom 0.305: U$7.13 55.16,52.6 55.75,53.19 55.75,53.72 55.23,54.24 JP3.2
RX1IN_N
  Bottom 0.305: U$7.47 40.27,52.1 38.99,50.82 38.99,46.5 38.39,45.91 U$1.50
RX1IN_P
  Bottom 0.305: U$7.48 40.05,52.6 38.48,51.03 38.48,46.74 38.43,46.68 38.43,46.66 38.18,46.41 U$1.48
RX2_N
  Bottom 0.305: U$7.16 57.18,51.1 58.65,52.58 59.44,52.58 60.08,51.93 JP4.1
RX2_P
  Bottom 0.305: U$7.15 56.96,51.6 58.44,53.09 59.44,53.09 60.08,53.73 JP4.2
RX2IN_N
  Bottom 0.305: U$7.45 43.75,51.05 40.87,51.05 40.01,50.19 40.01,45.87 38.52,44.39 36.89,44.39 36.87,44.41 U$1.56
RX2IN_P
  Bottom 0.305: U$7.46 43.66,51.56 40.66,51.56 39.5,50.4 39.5,46.08 38.31,44.89 36.89,44.89 36.88,44.91 U$1.54
RX3_N
  Bottom 0.305: U$7.20 56.33,49.1 58.32,47.12 59.31,47.12 60.08,46.34 JP5.1
RX3_P
  Bottom 0.305: U$7.19 56.55,49.6 58.52,47.62 59.31,47.62 60.08,48.4 JP5.2
RX3IN_N
  Bottom 0.305: U$1.62 38.57,42.91 41.15,45.49 41.15,48.41 41.71,48.97 41.84,49.1 U$7.41
RX3IN_P
  Bottom 0.305: U$1.60 38.35,43.41 40.64,45.7 40.64,48.62 41.35,49.33 41.48,49.46 41.62,49.6 U$7.42
RX4_N
  Bottom 0.305: U$7.22 54.54,48.1 55.75,46.88 55.75,46.23 55.11,45.58 JP6.1
RX4_P
  Bottom 0.305: U$7.21 54.76,48.6 56.26,47.09 56.26,46.23 56.91,45.58 JP6.2
RX4IN_N
  Bottom 0.305: U$1.68 38.72,41.41 42.16,44.85 42.16,47.52 42.6,47.95 42.73,48.08 42.75,48.1 U$7.39
RX4IN_P
  Bottom 0.305: U$1.66 38.5,41.91 41.66,45.06 41.66,47.73 42.24,48.31 42.37,48.44 42.53,48.6 U$7.40
RX5_N
  Bottom 0.305: U$8.14 55.29,39.94 56.26,40.92 56.26,41.53 56.91,42.18 JP7.1
RX5_P
  Bottom 0.305: U$8.13 55.07,40.44 55.75,41.13 55.75,41.53 55.11,42.18 JP7.2
RX5IN_N
  Bottom 0.305: U$8.47 36.54,39.94 U$1.74
RX5IN_P
  Bottom 0.305: U$1.72 44.01,40.41 U$8.48
RX6_N
  Bottom 0.305: U$8.16 56.83,38.94 58.4,40.51 59.31,40.51 60.08,39.74 JP8.1
RX6_P
  Bottom 0.305: U$8.15 56.61,39.44 58.19,41.02 59.31,41.02 60.08,41.8 JP8.2
RX6IN_N
  Bottom 0.305: U$1.80 40.8,38.41 41.33,38.94 U$8.45
RX6IN_P
  Bottom 0.305: U$1.78 40.58,38.91 41.09,39.42 44.02,39.42 U$8.46
RX7_N
  Bottom 0.305: U$8.20 56.05,36.94 58.06,34.92 59.18,34.92 60.08,34.02 JP9.1
RX7_P
  Bottom 0.305: U$8.19 56.27,37.44 58.27,35.43 59.18,35.43 60.08,36.33 JP9.2
RX7IN_N
  Bottom 0.305: U$8.41 36.54,36.94 U$1.86
RX7IN_P
  Bottom 0.305: U$1.84 44.01,37.41 U$8.42
RX8_N
  Bottom 0.305: U$8.22 54.89,35.94 55.75,35.07 55.75,33.91 55.11,33.26 JP10.1
RX8_P
  Bottom 0.305: U$8.21 55.11,36.44 56.26,35.28 56.26,33.91 56.91,33.26 JP10.2
RX8IN_N
  Bottom 0.305: U$8.39 39.35,35.94 38.84,35.43 36.53,35.43 U$1.92
RX8IN_P
  Bottom 0.305: U$8.40 39.13,36.44 38.6,35.91 U$1.90
RX9_N
  Bottom 0.305: U$17.14 55.57,27.4 56.26,28.09 56.26,28.83 56.78,29.35 JP32.1
RX9_P
  Bottom 0.305: U$17.13 55.35,27.9 55.75,28.3 55.75,28.83 55.23,29.35 JP32.2
RX9IN_N
  Bottom 0.305: U$1.104 43.87,27.41 U$17.47
RX9IN_P
  Bottom 0.305: U$17.48 U$1.102
RX10_N
  Bottom 0.305: U$17.16 56.85,26.4 58.27,27.81 59.06,27.81 59.96,26.91 JP33.1
RX10_P
  Bottom 0.305: U$17.15 56.64,26.9 58.06,28.32 59.06,28.32 59.96,29.22 JP33.2
RX10IN_N
  Bottom 0.305: U$1.110 41.25,25.91 41.76,26.42 43.9,26.42 | 43.94,26.42 43.9,26.42 | 43.9,26.42 U$17.45
RX10IN_P
  Bottom 0.305: U$1.108 41.04,26.41 41.55,26.92 43.91,26.92 | 43.94,26.92 43.91,26.92 | 43.91,26.92 U$17.46
RX11_N
  Bottom 0.305: U$17.20 56.14,24.4 58.44,22.1 59.31,22.1 59.96,21.45 JP34.1
RX11_P
  Bottom 0.305: U$17.19 56.36,24.9 58.65,22.61 59.31,22.61 59.96,23.25 JP34.2
RX11IN_N
  Bottom 0.305: U$1.116 43.87,24.41 U$17.41
RX11IN_P
  Bottom 0.305: U$17.42 U$1.114
RX12_N
  Bottom 0.305: U$17.22 54.35,23.4 55.75,21.99 55.75,21.34 54.98,20.56 JP35.1
RX12_P
  Bottom 0.305: U$17.21 54.57,23.9 56.26,22.2 56.26,21.34 57.04,20.56 JP35.2
RX12IN_N
  Bottom 0.305: U$17.39 38.61,23.4 38.47,23.25 38.41,23.19 38.28,23.06 38.13,22.91 U$1.122
RX12IN_P
  Bottom 0.305: U$17.40 38.4,23.9 38.05,23.55 37.92,23.42 37.91,23.41 U$1.120
RX13_N
  Bottom 0.305: U$18.14 55.31,13.55 56.26,14.5 56.26,15.24 56.91,15.89 JP36.1
RX13_P
  Bottom 0.305: U$18.13 55.1,14.05 55.75,14.71 55.75,15.24 55.11,15.89 JP36.2
RX13IN_N
  Bottom 0.305: U$18.47 42.6,13.55 41.4,14.75 41.4,20.47 40.46,21.41 40.39,21.41 | U$1.128 40.39,21.41 | 40.39,21.41 40.46,21.41 40.59,21.28
RX13IN_P
  Bottom 0.305: U$18.48 42.82,14.05 41.91,14.96 41.91,20.68 40.95,21.64 40.82,21.77 40.68,21.91 U$1.126
RX14_N
  Bottom 0.305: U$18.16 56.85,12.55 58.4,14.1 59.31,14.1 60.07,13.33 JP37.1
RX14_P
  Bottom 0.305: U$18.15 56.64,13.05 58.19,14.6 59.18,14.6 59.31,14.73 60.07,15.49 JP37.2
RX14IN_N
  Bottom 0.305: U$1.134 39.55,19.91 40.13,19.33 40.13,13.87 41.09,12.9 41.16,12.84 41.22,12.77 41.44,12.55 U$18.45
RX14IN_P
  Bottom 0.305: U$1.132 39.77,20.41 40.64,19.54 40.64,14.08 41.45,13.26 41.58,13.13 41.66,13.05 U$18.46
RX15_N
  Bottom 0.305: U$18.20 56.02,10.55 58.32,8.26 59.69,8.26 60.07,7.87 JP38.1
RX15_P
  Bottom 0.305: U$18.19 56.23,11.05 58.52,8.76 59.69,8.76 60.07,9.14 JP38.2
RX15IN_N
  Bottom 0.305: U$18.41 39.89,10.55 38.86,11.58 38.86,18.03 38.49,18.41 U$1.140
RX15IN_P
  Bottom 0.305: U$1.138 38.98,18.91 39.37,18.52 39.37,11.79 39.42,11.74 40.06,11.1 40.11,11.05 U$18.42
RX16_N
  Bottom 0.305: U$18.22 54.6,9.55 55.63,8.53 55.63,7.37 54.98,6.72 JP39.1
RX16_P
  Bottom 0.305: U$18.21 54.82,10.05 56.13,8.74 56.13,7.37 56.78,6.72 JP39.2
RX16IN_N
  Bottom 0.305: U$1.146 37.34,16.91 37.72,16.53 37.72,10.69 38.88,9.53 43.86,9.53 U$18.39
RX16IN_P
  Bottom 0.305: U$1.144 37.56,17.41 38.23,16.74 38.23,10.9 39.09,10.03 43.86,10.03 U$18.40
TX1_N
  Bottom 0.305: U$4.47 10.22,52.16 9.53,52.85 9.53,53.59 8.87,54.25 JP13.2
TX1_P
  Bottom 0.305: U$4.48 10.44,52.66 10.03,53.06 10.03,53.59 10.69,54.25 JP13.1
TX1IN_N
  Bottom 0.305: U$1.49 28.92,45.91 28.32,46.5 28.32,51.82 28.27,51.87 28.27,51.89 28,52.16 U$4.14
TX1IN_P
  Bottom 0.305: U$1.47 29.13,46.41 28.83,46.71 28.83,52.05 28.22,52.66 U$4.13
TX2_N
  Bottom 0.305: U$4.45 8.17,51.16 7.13,52.2 6.48,52.2 5.71,51.43 JP14.2
TX2_P
  Bottom 0.305: U$4.46 8.39,51.66 7.34,52.7 6.48,52.7 5.71,53.47 JP14.1
TX2IN_N
  Bottom 0.305: U$4.16 26.97,51.16 27.18,50.95 27.18,44.98 27.75,44.41 U$1.55
TX2IN_P
  Bottom 0.305: U$4.15 27.18,51.66 27.69,51.16 27.69,45.21 27.74,45.16 27.74,45.14 27.97,44.91 U$1.53
TX3_N
  Bottom 0.305: U$4.41 9.39,49.16 7.34,47.12 6.35,47.12 5.71,46.48 JP15.2
TX3_P
  Bottom 0.305: U$4.42 9.17,49.66 7.13,47.62 6.35,47.62 5.71,48.26 JP15.1
TX3IN_N
  Bottom 0.305: U$4.20 25.03,49.16 25.78,48.41 25.78,43.71 26.58,42.91 U$1.61
TX3IN_P
  Bottom 0.305: U$4.19 25.25,49.66 26.29,48.62 26.29,43.94 26.34,43.89 26.34,43.87 26.8,43.41 U$1.59
TX4_N
  Bottom 0.305: U$4.39 11.31,48.16 10.03,46.88 10.03,46.48 11.01,45.51 JP16.2
TX4_P
  Bottom 0.305: U$4.40 11.09,48.66 9.53,47.09 9.53,46.48 8.55,45.51 JP16.1
TX4IN_N
  Bottom 0.305: U$1.67 26.18,41.41 24.64,42.95 24.64,47.77 24.25,48.16 U$4.22
TX4IN_P
  Bottom 0.305: U$1.65 26.4,41.91 25.15,43.16 25.15,48.01 25.12,48.01 | U$4.21 24.47,48.66 25.01,48.12 25.12,48.01 | 25.12,48.01 25.15,47.98 25.15,43.18
TX5_N
  Bottom 0.305: U$6.47 10.6,39.84 9.53,40.92 9.53,41.53 8.81,42.25 JP17.2
TX5_P
  Bottom 0.305: U$6.48 10.82,40.34 10.03,41.13 10.03,41.53 10.75,42.25 JP17.1
TX5IN_N
  Bottom 0.305: U$6.14 30.26,39.84 U$1.73
TX5IN_P
  Bottom 0.305: U$1.71 22.99,40.41 U$6.13
TX6_N
  Bottom 0.305: U$6.45 8.55,38.84 7.26,40.13 6.35,40.13 5.71,39.5 JP18.2
TX6_P
  Bottom 0.305: U$6.46 8.77,39.34 7.47,40.64 6.35,40.64 5.71,41.27 JP18.1
TX6IN_N
  Bottom 0.305: U$6.16 27.98,38.84 28.41,38.41 U$1.79
TX6IN_P
  Bottom 0.305: U$6.15 28.2,39.34 28.63,38.91 U$1.77
TX7_N
  Bottom 0.305: U$6.41 9.13,36.84 7.34,35.05 6.35,35.05 5.71,34.42 JP19.2
TX7_P
  Bottom 0.305: U$6.42 8.92,37.34 7.13,35.56 6.35,35.56 5.71,36.2 JP19.1
TX7IN_N
  Bottom 0.305: U$1.85 29.42,36.91 29.34,36.83 22.93,36.83 U$6.20
TX7IN_P
  Bottom 0.305: U$6.19 29.21,37.34 29.27,37.4 U$1.83
TX8_N
  Bottom 0.305: U$6.39 11.31,35.84 10.03,34.57 10.03,33.91 10.62,33.32 JP20.2
TX8_P
  Bottom 0.305: U$6.40 11.09,36.34 9.53,34.78 9.53,33.91 8.93,33.32 JP20.1
TX8IN_N
  Bottom 0.305: U$6.22 28.12,35.84 28.56,35.41 U$1.91
TX8IN_P
  Bottom 0.305: U$6.21 28.34,36.34 28.77,35.91 U$1.89
TX9_N
  Bottom 0.305: U$15.47 10.09,27.4 9.53,27.96 9.53,28.7 8.93,29.29 JP31.2
TX9_P
  Bottom 0.305: U$15.48 10.31,27.9 10.03,28.17 10.03,28.7 10.62,29.29 JP31.1
TX9IN_N
  Bottom 0.305: U$1.103 22.93,27.41 U$15.14
TX9IN_P
  Bottom 0.305: U$15.13 30.31,27.9 U$1.101
TX10_N
  Bottom 0.305: U$15.45 8.04,26.4 7.01,27.43 6.35,27.43 5.71,26.8 JP30.2
TX10_P
  Bottom 0.305: U$15.46 8.26,26.9 7.22,27.94 6.35,27.94 5.71,28.57 JP30.1
TX10IN_N
  Bottom 0.305: U$15.16 27.79,26.4 28.14,26.05 28.14,26.02 28.26,25.91 U$1.109
TX10IN_P
  Bottom 0.305: U$15.15 28.01,26.9 28.5,26.41 28.51,26.41 U$1.107
TX11_N
  Bottom 0.305: U$15.41 9.9,24.4 7.34,21.84 6.48,21.84 5.71,21.08 JP29.2
TX11_P
  Bottom 0.305: U$15.42 9.68,24.9 7.13,22.35 6.48,22.35 5.71,23.11 JP29.1
TX11IN_N  (1 unrouted)
  Bottom 0.305: U$1.115 23.46,24.41 23.43,24.38
TX11IN_P
  Bottom 0.305: U$15.19 30.31,24.9 U$1.113
TX12_N
  Bottom 0.305: U$15.39 11.44,23.4 10.03,21.99 10.03,21.34 10.75,20.62 JP28.2
TX12_P
  Bottom 0.305: U$15.40 11.22,23.9 9.53,22.2 9.53,21.46 | 9.53,21.46 9.53,21.34 | JP28.1 8.68,20.62 9.53,21.46
TX12IN_N
  Bottom 0.305: U$15.22 28.19,23.4 28.68,22.91 U$1.121
TX12IN_P
  Bottom 0.305: U$15.21 28.41,23.9 28.89,23.41 U$1.119
TX13_N
  Bottom 0.305: U$16.47 10.6,13.55 9.53,14.63 9.53,15.49 8.93,16.09 JP27.2
TX13_P
  Bottom 0.305: U$16.48 10.82,14.05 10.03,14.84 10.03,15.49 10.62,16.09 JP27.1
TX13IN_N
  Bottom 0.305: U$1.127 26.34,21.41 25.02,20.09 25.02,13.97 24.6,13.55 U$16.14
TX13IN_P
  Bottom 0.305: U$1.125 26.12,21.91 24.51,20.3 24.51,14.48 24.08,14.05 U$16.13
TX14_N
  Bottom 0.305: U$16.45 9.06,12.55 7.52,14.1 6.6,14.1 5.71,13.21 JP26.2
TX14_P
  Bottom 0.305: U$16.46 9.28,13.05 7.72,14.6 6.6,14.6 5.71,15.49 JP26.1
TX14IN_N
  Bottom 0.305: U$16.16 25.1,12.55 26.42,13.87 26.42,19.45 26.87,19.91 U$1.133
TX14IN_P
  Bottom 0.305: U$16.15 24.88,13.05 25.91,14.08 25.91,19.66 26.65,20.41 U$1.131
TX15_N
  Bottom 0.305: U$16.41 9.64,10.55 7.47,8.38 6.48,8.38 5.71,7.62 JP25.2
TX15_P
  Bottom 0.305: U$16.42 9.42,11.05 7.26,8.89 6.48,8.89 5.71,9.65 JP25.1
TX15IN_N  (1 unrouted)
  Bottom 0.305: U$1.139 27.69,18.41 27.69,11.83 26.72,10.87 26.66,10.81 26.6,10.74 26.4,10.55 U$16.20 | 27.79,18.41 27.61,18.23
TX15IN_P
  Bottom 0.305: U$1.137 27.57,18.91 27.18,18.52 27.18,12.04 26.49,11.36 26.36,11.23 26.24,11.1 26.18,11.05 U$16.19
TX16_N
  Bottom 0.305: U$16.39 11.05,9.55 10.03,8.53 10.03,7.87 10.75,7.16 JP24.2
TX16_P
  Bottom 0.305: U$16.40 10.83,10.05 9.53,8.74 9.53,7.87 8.81,7.16 JP24.1
TX16IN_N  (1 unrouted)
  Bottom 0.305: U$1.145 28.96,16.91 28.96,10.44 28.05,9.53 22.94,9.53 U$16.22 | 29.08,16.91 28.88,16.71
TX16IN_P
  Bottom 0.305: U$1.143 28.86,17.41 28.45,17 28.45,10.65 27.84,10.03 22.94,10.03 U$16.21
VCC  (via drill 0.61)  (1 unrouted)
  Bottom 0.305: U$1.51 31.68,45.41 v32.13,45.34 32.13,44.2 | U$1.57 31.84,43.91 32.13,44.2 | U$16.29 U$16.30 18.92,9.27 | U$16.28 U$16.29 | U$15.32 U$15.33 17.78,21.26 17.78,22.61 18.16,22.99 18.92,22.99 | U$15.29 19.42,20.94 19.43,20.95 18.92,20.95 | U$7.7 48.45,51.88 | U$7.3 U$7.4 U$7.5 47.45,52.05 47.62,51.88 48.45,51.88 | U$7.11 U$7.10 50.29,54.1 50.29,52.64 49.53,51.88 | 49.53,51.88 48.45,51.88 | 49.45,47.88 U$7.28 U$7.29 | 49.45,47.88 49.45,51.8 49.53,51.88 | U$7.33 U$7.32 47.45,47.33 48.01,47.88 49.45,47.88 | U$7.30 U$7.29 | U$7.29 48.95,43.75 48.51,43.31 48.51,41.97 | 48.51,41.97 U$8.7 | U$8.11 U$8.10 50.04,39.88 49.53,39.37 49.02,39.37 | U$8.3 U$8.4 | U$8.4 U$8.5 47.54,39.96 48.13,39.37 48.77,39.37 | 48.77,39.37 49.02,39.37 | 48.51,41.97 48.51,39.62 48.77,39.37 | U$8.29 49.04,36.07 | 49.04,36.07 49.04,39.35 49.02,39.37 | 47.05,41.95 U$8.4 | U$8.33 U$8.32 47.54,35.6 48.01,36.07 49.04,36.07 | U$8.30 U$8.29 | U$8.29 U$8.28 | U$17.7 48.39,31.62 49.02,32.26 49.02,33.42 U$8.29 | U$17.7 | U$17.11 U$17.10 49.88,27.02 49.53,26.67 48.9,26.67 | U$17.3 U$17.4 U$17.5 47.38,26.91 47.62,26.67 48.9,26.67 | U$17.7 48.39,27.18 48.9,26.67 | 48.9,26.67 48.9,23.24 | 48.9,23.24 48.9,20.91 U$17.29 | U$17.29 U$17.30 U$18.7 48.38,12.95 | U$17.29 U$17.28 | U$17.33 U$17.32 47.38,22.49 48.13,23.24 48.9,23.24 | U$18.3 U$18.4 U$18.5 47.38,13.2 47.62,12.95 48.26,12.95 48.38,12.83 | 48.38,9.65 U$18.30 U$18.29 U$18.28 | 48.38,9.65 48.38,12.83 | 48.38,12.83 48.38,12.95 | 48.38,12.95 49.53,12.95 49.88,13.31 U$18.10 U$18.11 | U$18.33 U$18.32 47.38,9.28 47.75,9.65 48.38,9.65 | U$4.10 U$4.11 20.7,54.38 20.7,55.37 | U$4.7 18.92,52.2 | 18.92,52.2 18.92,48.26
  Bottom 0.305: 18.92,48.26 U$4.30 | U$4.30 U$6.7 | U$6.7 18.92,39.5 | 18.92,39.5 18.92,35.56 | 18.92,35.56 U$6.30 | U$6.30 U$15.7 18.92,27.3 | U$15.30 18.92,13.33 | 18.92,13.33 18.92,9.27 | U$4.10 20.77,54.16 20.83,54.1 20.83,54.23 | U$4.3 U$4.4 U$4.5 17.92,52.31 18.03,52.2 18.92,52.2 | U$4.10 20.42,52.55 20.07,52.2 18.92,52.2 | U$4.33 U$4.32 17.92,47.76 18.41,48.26 18.92,48.26 | U$4.30 U$4.29 U$4.28 | U$4.30 18.92,45.34 U$6.7 | U$6.3 U$6.4 U$6.5 17.92,39.74 18.16,39.5 18.92,39.5 | U$6.11 20.92,41.82 20.95,41.78 20.48,41.78 | 20.48,41.78 U$6.10 20.42,40.1 19.81,39.5 18.92,39.5 | U$6.28 U$6.29 U$6.30 | U$6.33 U$6.32 17.92,35.32 18.16,35.56 18.92,35.56 | U$15.3 U$15.4 U$15.5 17.92,27.67 18.29,27.3 18.92,27.3 | U$15.11 U$15.10 20.42,27.91 19.81,27.3 18.92,27.3 | 18.92,27.3 18.92,22.99 | 18.92,22.99 U$15.30 | U$15.29 U$15.28 | U$15.29 U$15.30 | U$16.4 U$16.5 | U$16.5 U$16.3 | U$16.5 17.92,13.83 18.41,13.33 18.92,13.33 | 18.92,13.33 19.56,13.33 20.42,14.2 U$16.10 U$16.11 | 18.92,9.27 18.16,9.27 17.92,9.03 U$16.32 U$16.33 17.42,5.52 C1.1 C3.1 | U$1.63 32,42.41 32.13,42.55 | 32.13,42.55 32.13,44.2 | U$1.75 31.41,39.41 32.13,40.13 32.13,40.77 | 32.13,42.55 32.13,41.02 32.02,40.91 U$1.69 | 20.48,41.78 20.45,41.78 | C4.1 19.98,4.66 19.43,5.21 U$16.29
  Bottom 0.406: 32.13,42.55 32.13,50.04 26.54,55.63 20.95,55.63 20.7,55.37 | 32.13,41.02 32.13,40.77 33.91,40.77 34.67,41.53 34.67,49.53 41.66,56.52 46.74,56.52 46.86,56.39 46.86,54.19 U$7.4

### Text on the board
tPlace: p | p | p | p | TX_2 | Rx_2 | TX_1 | Rx_1 | p | p | TX_3 | Rx_3 | GND | TX_4 | Rx_4 | GND | p | p | p | p | p | p | TX_5 | Rx_5 | TX_6 | Rx_6 | p | p | Rx_8 | GND | TX_7 | TX_8 | Rx_7 | GND | p | p | p | p | p | TX_10 | TX_9 | p | p | TX_11 | p | GND | TX_12 | GND | p | p | p | p | p | p | TX_13 | TX_14 | p | p | GND | TX_16 | TX_15 | GND | p | p
tNames: SPW_DE-4 NSEE rev2